# EAGLE schematic LB1836M_breakout (EAGLE 6.3)
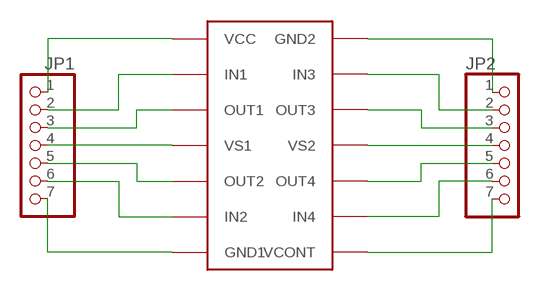
[diagram p0: schematic, sheet 1]

## Parts
JP1  PINHD-1X7  [1X07]
JP2  PINHD-1X7  [1X07]
LB1836M  LB1836M  [MFP-14]

## Nets
N$1: JP2.1 LB1836M.GN2(GND2)
N$2: JP2.2 LB1836M.IN3
N$3: JP2.3 LB1836M.OUT3
N$4: JP2.4 LB1836M.VS2
N$5: JP2.5 LB1836M.OUT4
N$6: JP2.6 LB1836M.IN4
N$7: JP2.7 LB1836M.VCONT
N$8: JP1.1 LB1836M.VCC
N$9: JP1.2 LB1836M.IN1
N$10: JP1.3 LB1836M.OUT1
N$11: JP1.4 LB1836M.VS1
N$12: JP1.5 LB1836M.OUT2
N$13: JP1.6 LB1836M.IN2
N$14: JP1.7 LB1836M.GND1

## Library data of the parts
JP1 JP2 = pinhead:PINHD-1X7: PIN HEADER
LB1836M = jeroen:LB1836M: The LB1836M is a low-saturation two-channel bidirectional motor driver IC for use in low-voltage applications. The LB1836M is a bipolar stepper-motor driver IC that is ideal for use in printers, FDDs, cameras and other portable devices.